# Altium schematic sheet Power.SchDoc (part 3 of 3)
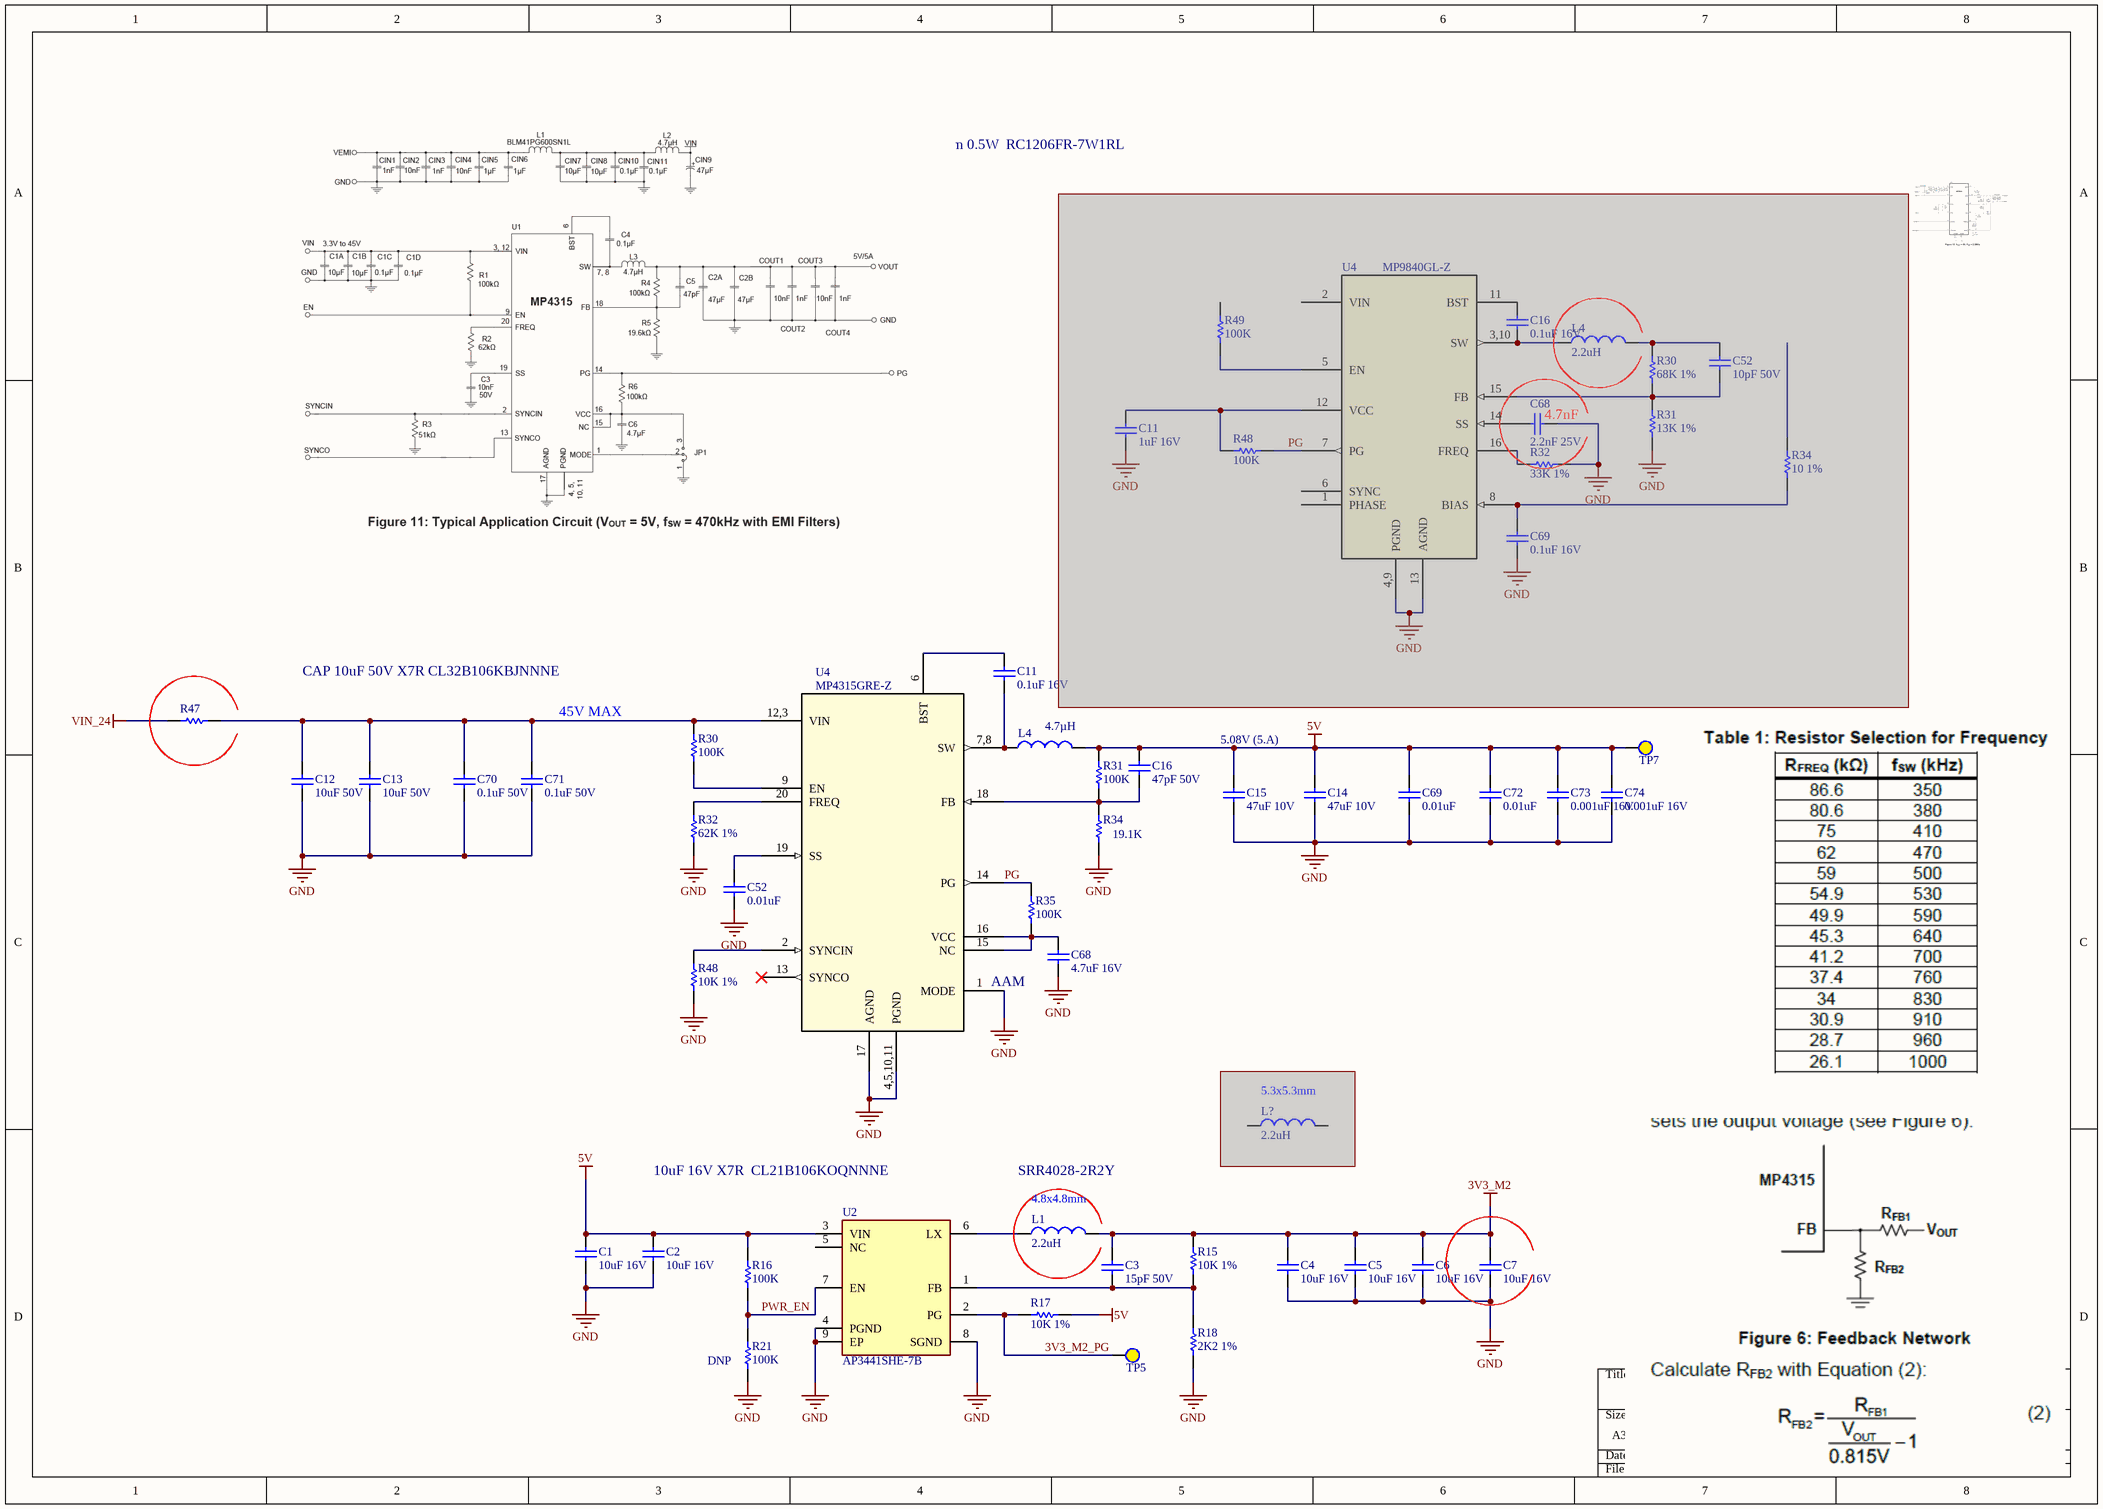
[diagram p2: Power.SchDoc]

## Library data of the parts (continued)
R34#2 = Res_19K1_0402: Res Thick Film 0402 19.1K Ohm 1% 0.063W(1/16W) ±100ppm/C Pad SMD T/R Automotive AEC-Q200; Manufacturer: Yageo Group; Manufacturer Part Number: AC0402FR-0719K1L; Value: 19.1kΩ; Temperature Coefficient: 100ppm/°C; Max Power Dissipation: 63mW; Power Dissipation: 62.5mW; Voltage Rating: 50V; Supplier 1: Mouser; RoHS: Compliant; Category: Chip SMD Resistors; Packaging: Tape & Reel; Tolerance: 1%; Composition: Thick Film; Features: Automotive AEC-Q200, Moisture Resistant; Height: 320µm; Number of Terminations: 2; ComponentLink1URL: https://datasheet.octopart.com:443/AC0402FR-0719K1L-Yageo-datasheet-182189377.pdf?src-supplier=IHS; ComponentLink1Description: https://datasheet.octopart.com:443/AC0402FR-0719K1L-Yageo-datasheet-182189377.pdf?src-supplier=IHS; Supplier Part Number 1: 603-AC0402FR-0719K1L; Supplier: Mouser; Supplier Part Number: 603-AC0402FR-0719K1L; Stock: 45979; Pricing: 1=0.1, 1=0.086, 10=0.008, 10=0.007, 50=0.008, 100=0.005, 100=0.004, 1000=0.005, 10000=0.002, 10000=0.002 (USD); Case/Package: 0402; Case Code (Imperial): 0402; Case Code (Metric): 1005; China RoHS: Non-Compliant; Length: 990.6µm; Lifecycle Status: Production; Max Operating Temperature: 155°C; Min Operating Temperature: -55°C; Mounting Technology: Surface Mount; Number of Terminals: 2; Power Rating: 62.5mW; REACH SVHC: Yes; Schedule B: 8533210045, 8533210045|8533210045|8533210045|8533210045|8533210045; Termination: SMD/SMT; Weight: 652.039032µg; Width: 500µm; Working Voltage: 50V; ComponentLink2URL: https://datasheet.octopart.com:443/AC0402FR-0719K1L-Yageo-datasheet-83209224.pdf?src-supplier=Upverter; ComponentLink2Description: https://datasheet.octopart.com:443/AC0402FR-0719K1L-Yageo-datasheet-83209224.pdf?src-supplier=Upverter; ComponentLink3URL: https://datasheet.octopart.com:443/AC0402FR-0719K1L-Yageo-datasheet-178509465.pdf?src-supplier=element14+APAC; ComponentLink3Description: https://datasheet.octopart.com:443/AC0402FR-0719K1L-Yageo-datasheet-178509465.pdf?src-supplier=element14+APAC; ComponentLink4URL: https://datasheet.octopart.com:443/AC0402FR-0719K1L-Yageo-datasheet-166720450.pdf?src-supplier=Future+Electronics; ComponentLink4Description: https://datasheet.octopart.com:443/AC0402FR-0719K1L-Yageo-datasheet-166720450.pdf?src-supplier=Future+Electronics; ComponentLink5URL: https://datasheet.octopart.com:443/AC0402FR-0719K1L-Yageo-datasheet-151884373.pdf?src-supplier=Future+Electronics; ComponentLink5Description: https://datasheet.octopart.com:443/AC0402FR-0719K1L-Yageo-datasheet-151884373.pdf?src-supplier=Future+Electronics; ComponentLink6URL: https://datasheet.octopart.com:443/AC0402FR-0719K1L-Yageo-datasheet-137699919.pdf?src-supplier=Future+Electronics; ComponentLink6Description: https://datasheet.octopart.com:443/AC0402FR-0719K1L-Yageo-datasheet-137699919.pdf?src-supplier=Future+Electronics; ComponentLink7URL: https://datasheet.octopart.com:443/AC0402FR-0719K1L-Yageo-Group-datasheet-164768995.pdf?src-supplier=ODG+(Origin+Data+Global); ComponentLink7Description: https://datasheet.octopart.com:443/AC0402FR-0719K1L-Yageo-Group-datasheet-164768995.pdf?src-supplier=ODG+(Origin+Data+Global); ComponentLink8URL: https://datasheet.octopart.com/AC0402FR-0719K1L-Yageo-datasheet-12512238.pdf; ComponentLink8Description: https://datasheet.octopart.com/AC0402FR-0719K1L-Yageo-datasheet-12512238.pdf; ComponentLink9URL: https://datasheet.octopart.com:443/AC0402FR-0719K1L-Yageo-datasheet-140571090.pdf?src-supplier=Arrow.cn; ComponentLink9Description: https://datasheet.octopart.com:443/AC0402FR-0719K1L-Yageo-datasheet-140571090.pdf?src-supplier=Arrow.cn; ComponentLink10URL: http://sigma.octopart.com:80/rohs_statement/Yageo-company-2.pdf?src-supplier=Compliance+Statements; ComponentLink10Description: http://sigma.octopart.com:80/rohs_statement/Yageo-company-2.pdf?src-supplier=Compliance+Statements; ComponentLink11URL: http://sigma.octopart.com:80/conflict_mineral_statement/Yageo-company-3.pdf?src-supplier=Compliance+Statements; ComponentLink11Description: http://sigma.octopart.com:80/conflict_mineral_statement/Yageo-company-3.pdf?src-supplier=Compliance+Statements
R47 = Res_1206: Resistor 1206
U2 = AP3441SHE-7B: DC-DC Switching Buck Regulator, Adjustable, 2.7 V to 5.5V in, 0.6 V to 5.5 V/3 A out, UDFN2020-EP-8; Manufacturer_Name: Diodes Incorporated; Manufacturer: Diodes Inc.; Max Switching Frequency: 1.2MHz; Min Input Voltage: 2.7V; Min Output Voltage: 600mV; Nominal Supply Voltage: 5V; Nominal Output Voltage: 2.5V; Number of Circuits: 1; Datasheet Link: https://www.diodes.com//assets/Datasheets/AP3441-L.pdf; Height: 0.6mm; Manufacturer_Part_Number: AP3441SHE-7B; Mouser Part Number: 621-AP3441SHE-7B; Mouser Price/Stock: https://www.mouser.co.uk/ProductDetail/Diodes-Incorporated/AP3441SHE-7B?qs=wUXugUrL1qwsM8sMU6r4Ag%3D%3D; Arrow Part Number: AP3441SHE-7B; Arrow Price/Stock: https://www.arrow.com/en/products/ap3441she-7b/diodes-incorporated?region=nac; Supplier: Mouser; Supplier Part Number: 621-AP3441SHE-7B; Manufacturer Part Number: AP3441SHE-7B; RoHS: Compliant; Category: Voltage Regulators - Switching; Stock: 7594; Pricing: 1=0.31, 10=0.215, 50=0.191, 100=0.164, 1000=0.138, 10000=0.127 (USD); China RoHS: Compliant; Height - Seated (Max): 600µm; Length: 2mm; Lifecycle Status: Production; Max Supply Voltage: 5.5V; Max Operating Temperature: 85°C; Max Output Voltage: 5.5V; Min Operating Temperature: -40°C; Number of Terminals: 8; Operating Supply Voltage: 5V; REACH SVHC: Yes; Terminal Pitch: 500µm; Topology: Buck; Width: 2mm; ComponentLink1URL: https://datasheet.octopart.com:443/AP3441SHE-7B-Diodes-Inc.-datasheet-151209809.pdf?src-supplier=element14+APAC; ComponentLink1Description: https://datasheet.octopart.com:443/AP3441SHE-7B-Diodes-Inc.-datasheet-151209809.pdf?src-supplier=element14+APAC; ComponentLink2URL: https://sigma.octopart.com:443/151209808/technical_drawing/Diodes-Inc.-AP3441SHE-7B.pdf?src-supplier=Diodes+Inc+SCT; ComponentLink2Description: https://sigma.octopart.com:443/151209808/technical_drawing/Diodes-Inc.-AP3441SHE-7B.pdf?src-supplier=Diodes+Inc+SCT; Supplier 1: Mouser; Supplier Part Number 1: 621-AP3441SHE-7B
U4#1 = MP9840GL-Z: Switching Regulator, Current-mode, 3.5A, 2750kHz Switching Freq-Max; Manufacturer_Name: Monolithic Power Systems; Manufacturer Lifecycle Status: ACTIVE; Max Supply Voltage: 36V; Max Switching Frequency: 2.75MHz; Min Input Voltage: 3.3V; Nominal Supply Voltage: 12V; Number of Circuits: 1; Topology: Buck; Copyright: Copyright (C) 2025 Ultra Librarian. All rights reserved.; Manufacturer_Part_Number: MP9840GL-Z; Datasheet: https://www.monolithicpower.com/en/documentview/productdocument/index/version/2/document_type/Datasheet/lang/en/sku/MP9840GL; RefDes: RefDes; Type: Type; Supplier: Mouser; Supplier Part Number: 946-MP9840GL-Z; Manufacturer: Monolithic Power Systems; Manufacturer Part Number: MP9840GL-Z; RoHS: Compliant; Category: Voltage Regulators - Switching; Stock: 5000; Pricing: 1=2.56, 1=2.2, 10=1.91, 10=1.64, 25=1.51, 50=1.75, 100=1.57, 100=1.35, 250=1.27, 500=1.23, 1000=1.39, 1000=1.2, 2500=1.15, 5000=1.1, 10000=1.28 (USD); Height - Seated (Max): 1mm; Length: 4mm; Lifecycle Status: Production; Max Operating Temperature: 125°C; Max Output current: 3.5A; Min Operating Temperature: -40°C; Number of Terminals: 16; REACH SVHC: Yes; Terminal Pitch: 650µm; Width: 3mm; ComponentLink1URL: https://datasheet.octopart.com:443/MP9840GL-Z-Monolithic-Power-Systems-datasheet-163721617.pdf?src-supplier=Monolithic+Power+Systems; ComponentLink1Description: https://datasheet.octopart.com:443/MP9840GL-Z-Monolithic-Power-Systems-datasheet-163721617.pdf?src-supplier=Monolithic+Power+Systems; ComponentLink2URL: https://datasheet.octopart.com:443/MP9840GL-Z-Monolithic-Power-Systems-datasheet-180788465.pdf?src-supplier=IHS; ComponentLink2Description: https://datasheet.octopart.com:443/MP9840GL-Z-Monolithic-Power-Systems-datasheet-180788465.pdf?src-supplier=IHS; Supplier 1: Mouser; Supplier Part Number 1: 946-MP9840GL-Z
U4#2 = MP4315GRE-Z: MP4315 Series 45 V 5 A 1 MHz Surface Mount Buck Switching Regulator - QFN-20; Manufacturer_Name: Monolithic Power Systems; Manufacturer Lifecycle Status: ACTIVE; Max Supply Voltage: 45V; Max Output current: 5A; Max Output Voltage: 42.75V; Max Switching Frequency: 1.18MHz; Min Input Voltage: 3.3V; Min Output Voltage: 815mV; Nominal Supply Voltage: 12V; Number of Circuits: 1; Copyright: Copyright (C) 2025 Ultra Librarian. All rights reserved.; Manufacturer_Part_Number: MP4315GRE-Z; Datasheet: https://www.monolithicpower.com/en/documentview/productdocument/index/version/2/document_type/Datasheet/lang/en/sku/MP4315GRE; RefDes: RefDes; Type: Type; Supplier: DigiKey; Supplier Part Number: 1589-MP4315GRE-ZCT-ND; Manufacturer: Monolithic Power Systems; Manufacturer Part Number: MP4315GRE-Z; RoHS: Compliant; Category: Voltage Regulators - Switching; Stock: 1665; Pricing: 1=3.05, 10=2.285, 25=2.0928, 100=1.8822, 250=1.78168, 500=1.72112, 1000=1.67128, 2500=1.61865, 5000=1.58693 (USD); Height - Seated (Max): 1mm; Length: 4mm; Lifecycle Status: Production; Max Operating Temperature: 125°C; Min Operating Temperature: -40°C; Number of Terminals: 20; REACH SVHC: Yes; Topology: Buck; Width: 4mm; ComponentLink1URL: https://datasheet.octopart.com:443/MP4315GRE-Z-Monolithic-Power-Systems-datasheet-163719716.pdf?src-supplier=Monolithic+Power+Systems; ComponentLink1Description: https://datasheet.octopart.com:443/MP4315GRE-Z-Monolithic-Power-Systems-datasheet-163719716.pdf?src-supplier=Monolithic+Power+Systems; ComponentLink2URL: https://datasheet.octopart.com:443/MP4315GRE-Z-Monolithic-Power-Systems-datasheet-180787007.pdf?src-supplier=IHS; ComponentLink2Description: https://datasheet.octopart.com:443/MP4315GRE-Z-Monolithic-Power-Systems-datasheet-180787007.pdf?src-supplier=IHS; ComponentLink3URL: https://datasheet.octopart.com:443/MP4315GRE-Z-Monolithic-Power-Systems-datasheet-158879094.pdf?src-supplier=Future+Electronics; ComponentLink3Description: https://datasheet.octopart.com:443/MP4315GRE-Z-Monolithic-Power-Systems-datasheet-158879094.pdf?src-supplier=Future+Electronics; Supplier 1: DigiKey; Supplier Part Number 1: 1589-MP4315GRE-ZCT-ND